# EAGLE design PCB_v2 (EAGLE 8.6.2)
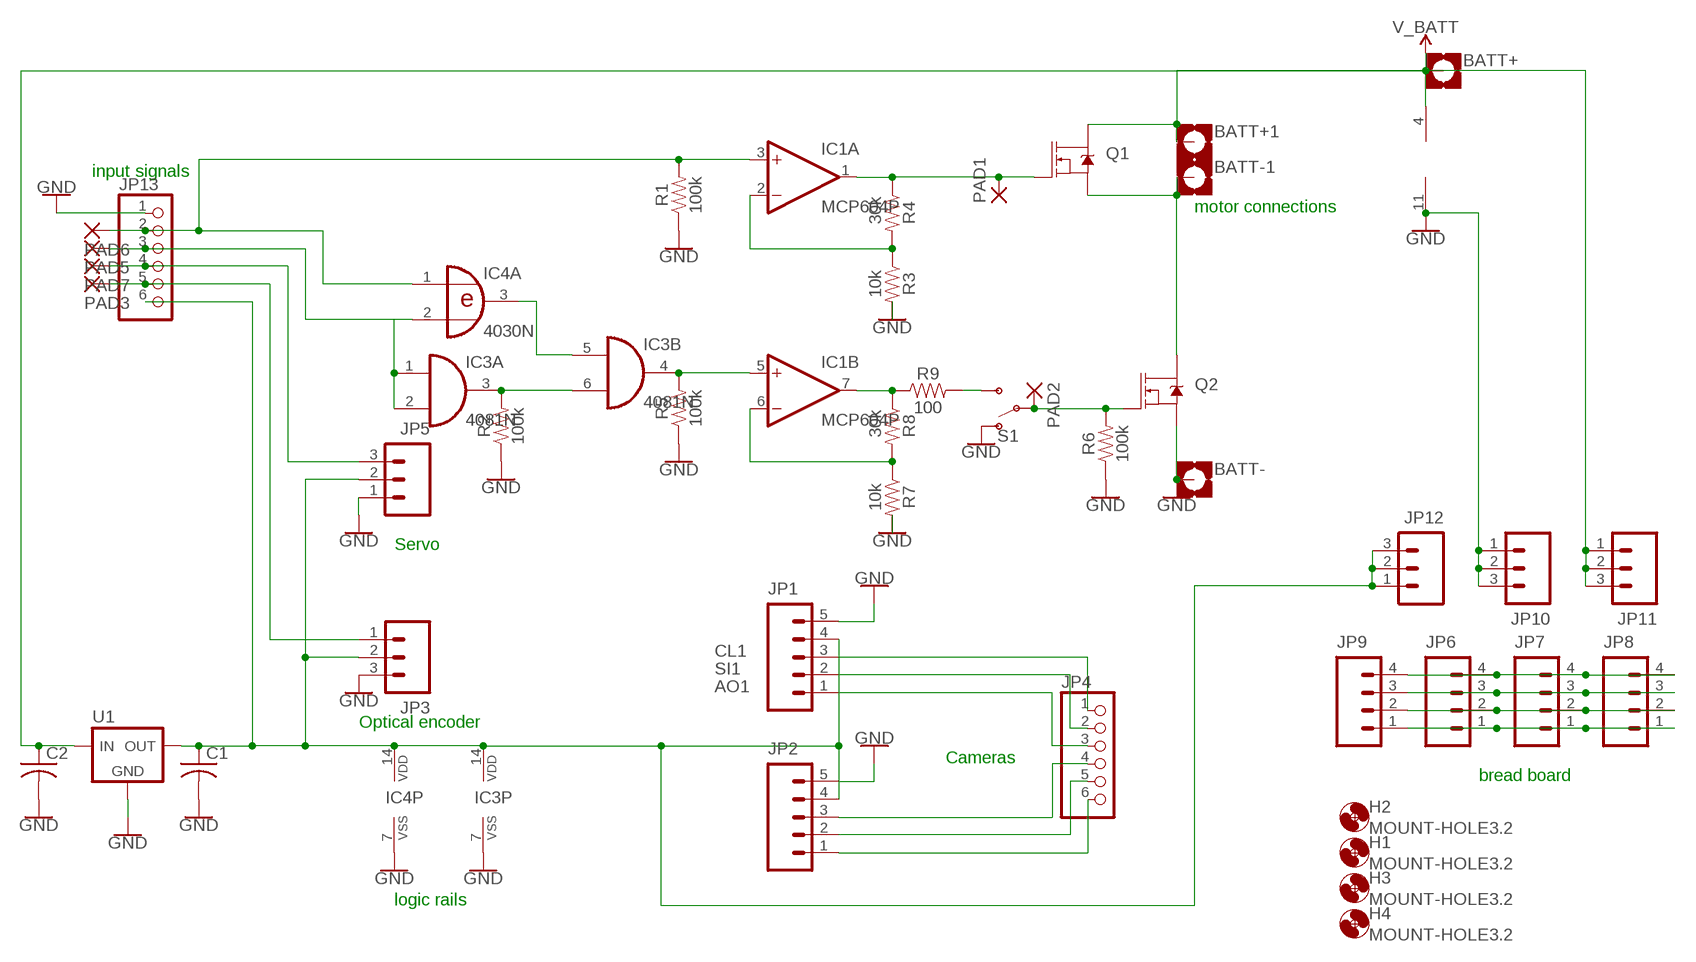
[diagram p0: schematic, sheet 1]

## Parts
BATT+  MOUNT-PAD-SQUARE3.0  [3,0-PAD-SQUARE]
BATT+1  MOUNT-PAD-SQUARE3.0  [3,0-PAD-SQUARE]
BATT-  MOUNT-PAD-SQUARE3.0  [3,0-PAD-SQUARE]
BATT-1  MOUNT-PAD-SQUARE3.0  [3,0-PAD-SQUARE]
C1  C-075PTH  [C075]
C2  C-075PTH  [C075]
H1  MOUNT-HOLE3.2  [3,2]
H2  MOUNT-HOLE3.2  [3,2]
H3  MOUNT-HOLE3.2  [3,2]
H4  MOUNT-HOLE3.2  [3,2]
IC1  MCP604P  [DIL14]
IC3  4081N  [DIL14]
IC4  4030N  [DIL14]
JP1  M05PTH  [1X05]
JP2  M05PTH  [1X05]
JP3  M03PTH  [1X03]
JP4  PINHD-1X6  [1X06]
JP5  M03PTH  [1X03]
JP6  M04PTH  [1X04]
JP7  M04PTH  [1X04]
JP8  M04PTH  [1X04]
JP9  M04PTH  [1X04]
JP10  M03PTH  [1X03]
JP11  M03PTH  [1X03]
JP12  M03PTH  [1X03]
JP13  PINHD-1X6  [1X06]
PAD1  2,15/1,0  [2,15/1,0]
PAD2  2,15/1,0  [2,15/1,0]
PAD3  2,15/1,0  [2,15/1,0]
PAD5  2,15/1,0  [2,15/1,0]
PAD6  2,15/1,0  [2,15/1,0]
PAD7  2,15/1,0  [2,15/1,0]
Q1  MOSFET-NCH-FQP30N06L  [TO220V]
Q2  MOSFET-NCH-FQP30N06L  [TO220V]
R1  100k  10KOHM-HORIZ-1/4W-1%  [AXIAL-0.3]
R2  100k  10KOHM-HORIZ-1/4W-1%  [AXIAL-0.3]
R3  10k  10KOHM-HORIZ-1/4W-1%  [AXIAL-0.3]
R4  30k  RESISTORAXIAL-0.3  [AXIAL-0.3]
R5  100k  10KOHM-HORIZ-1/4W-1%  [AXIAL-0.3]
R6  100k  10KOHM-HORIZ-1/4W-1%  [AXIAL-0.3]
R7  10k  10KOHM-HORIZ-1/4W-1%  [AXIAL-0.3]
R8  30k  RESISTORAXIAL-0.3  [AXIAL-0.3]
R9  100  10KOHM-HORIZ-1/4W-1%  [AXIAL-0.3]
S1  SWITCH-SPDT-PTH-11.6X4.0MM-KIT  [SWITCH_SPDT_PTH_11.6X4.0MM_KIT]
U1  78XX-TO220V  [TO220BV]

## Nets
AO1: JP1.1 JP4.3
CL1: JP1.3 JP4.1
GND: BATT-.B3,0(MOUNT) C1.2(-) C2.2(-) IC1.11(P:V-) IC3.7(P:VSS) IC4.7(P:VSS) JP1.5 JP2.5 JP3.3 JP5.1 JP10.1 JP10.2 JP10.3 JP13.1 Q2.3(S) R1.P$1 R2.P$1 R3.P$2 R5.P$1 R6.P$1 R7.P$2 S1.1(O) U1.2(GND)
N$1: IC1.2(A:-IN) R3.P$1 R4.P$2
N$2: IC1.1(A:OUT) PAD1.1(P) Q1.1(G) R4.P$1
N$3: IC1.6(B:-IN) R7.P$1 R8.P$2
N$4: R9.P$2 S1.3(S)
N$5: PAD2.1(P) Q2.1(G) R6.P$2 S1.2(P)
N$6: BATT-1.B3,0(MOUNT) Q1.3(S) Q2.2(D)
N$7: IC1.7(B:OUT) R8.P$1 R9.P$1
N$8: IC3.5(B:I0) IC4.3(A:O)
N$9: JP2.1 JP4.6
N$10: JP2.2 JP4.5
N$11: JP2.3 JP4.4
N$15: JP5.3 JP13.4 PAD7.1(P)
N$16: IC1.3(A:+IN) IC4.1(A:I0) JP13.2 PAD6.1(P) R1.P$2
N$18: C1.1(+) IC3.14(P:VDD) IC4.14(P:VDD) JP1.4 JP2.4 JP3.2 JP5.2 JP12.1 JP12.2 JP12.3 JP13.6 U1.3(VOUT)
N$19: JP3.1 JP13.5 PAD3.1(P)
N$20: IC1.5(B:+IN) IC3.4(B:O) R5.P$2
N$21: IC3.3(A:O) IC3.6(B:I1) R2.P$2
N$22: JP6.4 JP7.4 JP8.4 JP9.4
N$23: JP6.3 JP7.3 JP8.3 JP9.3
N$24: JP6.2 JP7.2 JP8.2 JP9.2
N$25: JP6.1 JP7.1 JP8.1 JP9.1
N$26: IC3.1(A:I0) IC3.2(A:I1) IC4.2(A:I1) JP13.3 PAD5.1(P)
SI1: JP1.2 JP4.2
V_BATT: BATT+1.B3,0(MOUNT) BATT+.B3,0(MOUNT) C2.1(+) IC1.4(P:V+) JP11.1 JP11.2 JP11.3 Q1.2(D) U1.1(VIN)
Unconnected: IC1.8(C:OUT) IC1.9(C:-IN) IC1.10(C:+IN) IC1.12(D:+IN) IC1.13(D:-IN) IC1.14(D:OUT) IC3.8(C:I0) IC3.9(C:I1) IC3.10(C:O) IC3.11(D:O) IC3.12(D:I0) IC3.13(D:I1) IC4.4(B:O) IC4.5(B:I0) IC4.6(B:I1) IC4.8(C:I0) IC4.9(C:I1) IC4.10(C:O) IC4.11(D:O) IC4.12(D:I0) IC4.13(D:I1)

## Notes on the sheet
- input signals
- motor connections
- Servo
- Optical encoder
- Cameras
- bread board
- logic rails

## Library data of the parts
BATT+ BATT+1 BATT- BATT-1 = holes:MOUNT-PAD-SQUARE: MOUNTING PAD, square
C1 C2 = bt_rcl:C: Capacitor, non-polarized, American symbol
H1-H4 = holes:MOUNT-HOLE: MOUNTING HOLE with drill center marker
IC1 = linear:MCP604: Quad Op Amp 2.7V to 6.0V Single Supply CMOS Source: http://ww1.microchip.com/downloads/en/DeviceDoc/21314g.pdf
IC3 = 40xx:4081: Quad 2-input AND
IC4 = 40xx:4030: Quad XOR
JP1 JP2 = ee192:M05: 5-pin 0.1-inch header and MTA connector Courtsey of Pioneers in Engineering; PIE-INT-REF-NUM: BULK-STOCK
JP3 JP5 JP10-JP12 = ee192:M03: 3-pin 0.1-inch header and MTA connector Courtsey of Pioneers in Engineering; PIE-INT-REF-NUM: BULK-STOCK
JP4 JP13 = pinhead:PINHD-1X6: PIN HEADER
JP6-JP9 = ee192:M04: 4-pin 0.1-inch header and MTA connector Courtsey of Pioneers in Engineering; PIE-INT-REF-NUM: BULK-STOCK
PAD1-PAD3 PAD5-PAD7 = wirepad:2,15/1,0: THROUGH-HOLE PAD
Q1 Q2 = SparkFun-DiscreteSemi:MOSFET-NCH: N-channel MOSFETs Voltage controlled devices that allow control of high current outputs. SparkFun Products: SparkFun OpenScale <https://www.sparkfun.com/products/13261> SparkFun Digital Sandbox <https://www.sparkfun.com/products/12651> SparkFun Monster Moto Shield <https://www.sparkfun.com/products/10182> SparkFun MOSFET Power Controller <https://www.sparkfun.com/products/11214>; PROD_ID: TRANS-10060; VALUE: 60V/32A/35mΩ
R1 R2 R5 R6 R9 = SparkFun-Resistors:10KOHM: 10kΩ resistor A resistor is a passive two-terminal electrical component that implements electrical resistance as a circuit element. Resistors act to reduce current flow, and, at the same time, act to lower voltage levels within circuits. - Wikipedia; PROD_ID: RES-12183; VALUE: 10k
R3 R7 = SparkFun-Resistors:10KOHM: 10kΩ resistor A resistor is a passive two-terminal electrical component that implements electrical resistance as a circuit element. Resistors act to reduce current flow, and, at the same time, act to lower voltage levels within circuits. - Wikipedia; PROD_ID: RES-12183
R4 R8 = SparkFun-Resistors:RESISTOR: Generic Resistor Package
S1 = SparkFun-Switches:SWITCH-SPDT: Single Pole, Double Throw (SPDT) Switch Single-pole, double-throw (SPDT) switch. Variant Overview SMD-AYZ0202 Surface Mount DPDT Switch <https://www.sparkfun.com/products/597> (COM-00597) Used on e.g. LilyPad Arduino USB - ATmega32U4 Board <https://www.sparkfun.com/products/12049> PTH-11.6X4.0MM SPDT Mini Power Switch <https://www.sparkfun.com/products/102> (COM-00102) Used on e.g. SparkFun Simon Says - Through-Hole Soldering Kit <https://www.sparkfun.com/products/10547> (KIT-10547) PTH-11.6X4.0MM-KIT KIT version of SPDT Mini Power Switch - Simplifies soldering by removing tStop of switch pins - only one side can be soldered. PTH-11.6X4.0MM-LOCK LOCK version of SPDT Mini Power Switch - Offset pins hold switch in place for easier soldering. SMD-RIGHT-ANGLE Surface Mount Right Angle Switch <https://www.sparkfun.com/products/10860> (COM-10860) Used on e.g. SparkFun ESP8266 Thing <https://www.sparkfun.com/products/13231>; PROD_ID: SWCH-08261; SF_SKU: COM-00102
U1 = bt_regulator:78XX: 78XX Linear Voltage Regulator The venerable 7800-series Linear Voltage Regulator, including 7805, 7809, 7812, 7815, 7862 in 5 V, 6.2 V, 8.2 V, 9 V, 12 V, and 15 V, respectively Datasheets TI_LM78L05.pdf <http://www.ti.com/lit/ds/symlink/lm78l05.pdf> Fairchild_LM7805.pdf <https://www.fairchildsemi.com/datasheets/LM/LM7805.pdf>

## Board
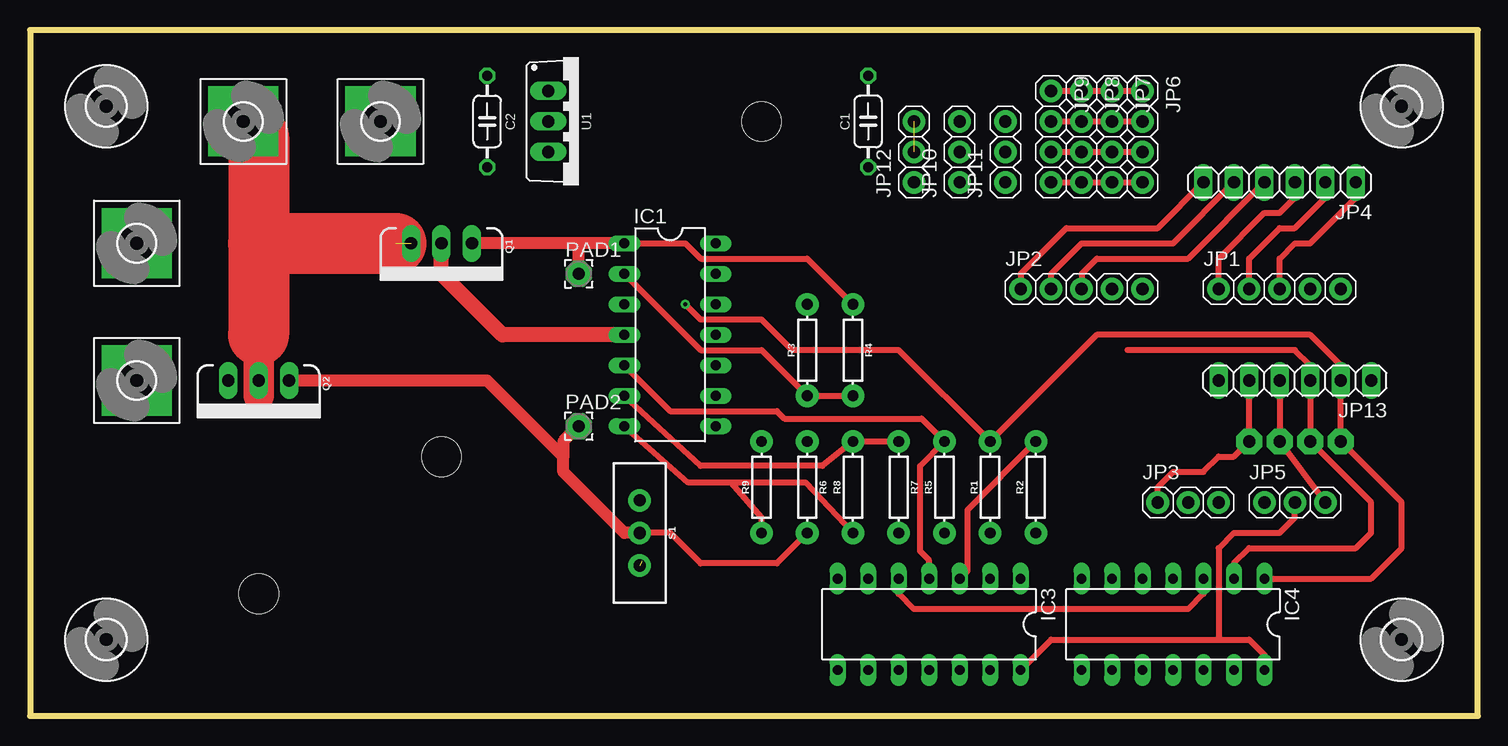
[diagram p1: board, top side]
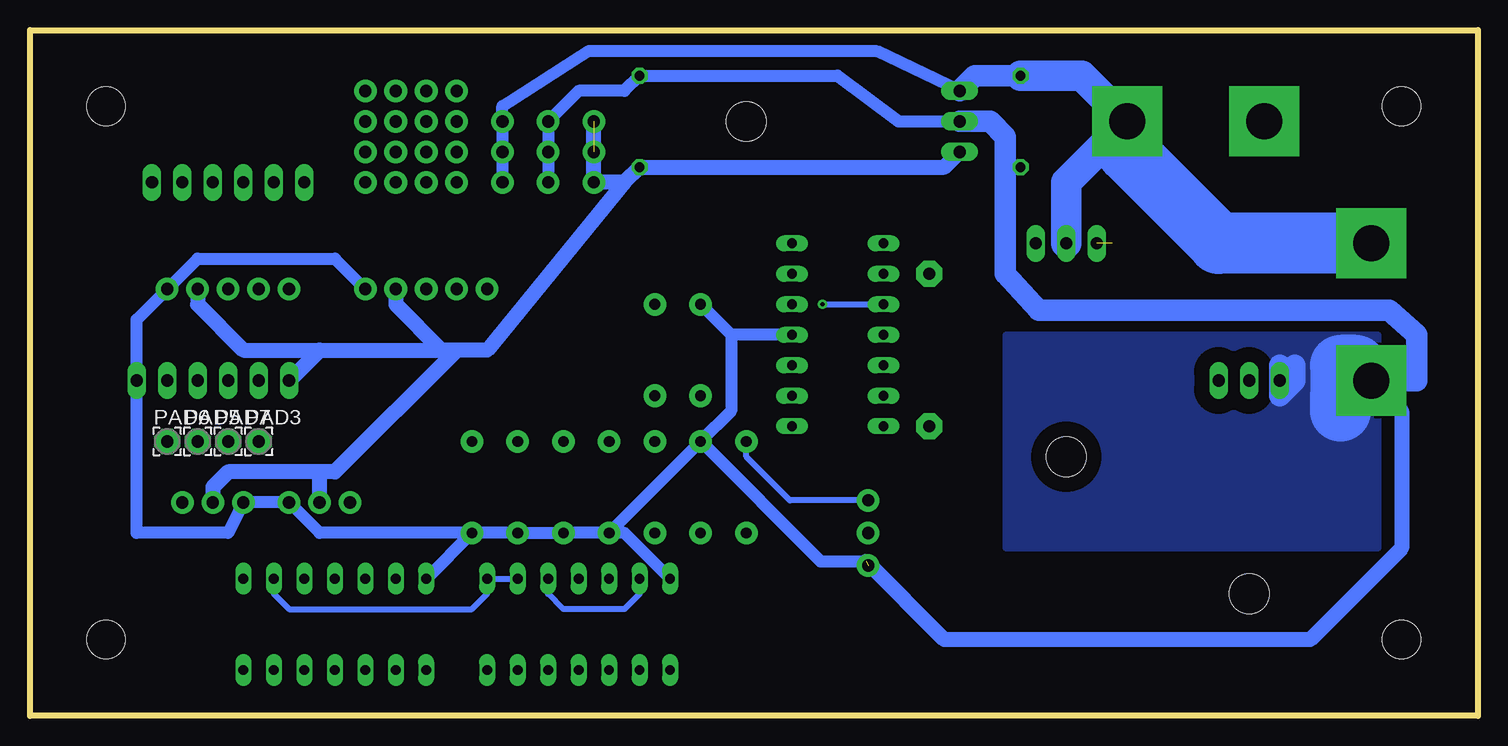
[diagram p2: board, bottom side, seen from below]

Size 120.65 x 57.15 mm. Coordinates in mm from the lower left corner, seen from the top.
Outline: 0,57.15 0,0 120.65,0 120.65,57.15 0,57.15
Copper layers (1*16): Top 0.035mm / dielectric 1.5mm / Bottom 0.035mm
Design rules "default": minimum track width 6mil, minimum drill 0.35mm, track to track 6mil, track to pad 6mil, pad to pad 6mil, via to via 6mil, smd to smd 6mil, copper to edge 40mil, drill to drill 6mil, minimum pad ring 10mil, minimum via ring 8mil, stop-mask expansion 4mil, vias tented up to drill 0mil, thermal gap 10mil
Holes 3.3 mm at 34.29,21.59 19.05,10.16 60.96,49.53

### Footprints (pad centres in the part's own frame; a part is rotated, then mirrored left to right if it is on the bottom)
3,0-PAD-SQUARE = drill 3 pad 5.842 square: B3,0 0,0
C075 = drill 0.813 octagon: 1 -3.81,0; 2 3.81,0
3,2 = hole 3.2: 0,0
DIL14 = drill 0.813 long: 1 -7.62,-3.81; 2 -5.08,-3.81; 3 -2.54,-3.81; 4 0,-3.81; 5 2.54,-3.81; 6 5.08,-3.81; 7 7.62,-3.81; 8 7.62,3.81; 9 5.08,3.81; 10 2.54,3.81; 11 0,3.81; 12 -2.54,3.81; 13 -5.08,3.81; 14 -7.62,3.81
1X05 = drill 1.016 pad 1.88: 1 -5.08,0; 2 -2.54,0; 3 0,0; 4 2.54,0; 5 5.08,0
1X03 = drill 1.016 pad 1.88: 1 -2.54,0; 2 0,0; 3 2.54,0
1X06 = drill 1.016 long: 1 -6.35,0; 2 -3.81,0; 3 -1.27,0; 4 1.27,0; 5 3.81,0; 6 6.35,0
1X04 = drill 1.016 pad 1.88: 1 -3.81,0; 2 -1.27,0; 3 1.27,0; 4 3.81,0
2,15/1,0 = drill 1.016 pad 2.159 octagon: 1 0,0
TO220V = drill 1.016 long: 1 -2.54,0; 2 0,0; 3 2.54,0
AXIAL-0.3 = drill 0.9 pad 1.88: P$1 -3.81,0; P$2 3.81,0
SWITCH_SPDT_PTH_11.6X4.0MM_KIT = drill 1.016 pad 1.88: 1 0,2.718; 2 0,0; 3 0,-2.718
TO220BV = drill 1.016 long: 1 -2.54,0; 2 0,0; 3 2.54,0

### Placement (x,y rotation side)
BATT+  8.89,39.37 0 top
BATT+1  29.21,49.53 0 top
BATT-  8.89,27.94 0 top
BATT-1  17.78,49.53 0 top
C1  69.85,49.53 90 top
C2  38.1,49.53 270 top
H1  114.3,6.35 0 top
H2  114.3,50.8 0 top
H3  6.35,50.8 0 top
H4  6.35,6.35 0 top
IC1  53.34,31.75 270 top
IC3  74.93,7.62 180 top
IC4  95.25,7.62 180 top
JP1  104.14,35.56 0 top
JP2  87.63,35.56 0 top
JP3  96.52,17.78 0 top
JP4  104.14,44.45 180 top
JP5  105.41,17.78 0 top
JP6  92.71,48.26 270 top
JP7  90.17,48.26 270 top
JP8  87.63,48.26 270 top
JP9  85.09,48.26 270 top
JP10  77.47,46.99 90 top
JP11  81.28,46.99 90 top
JP12  73.66,46.99 90 top
JP13  105.41,27.94 180 top
PAD1  45.72,36.83 0 top
PAD2  45.72,24.13 0 top
PAD3  101.6,22.86 0 bottom
PAD5  106.68,22.86 0 bottom
PAD6  109.22,22.86 0 bottom
PAD7  104.14,22.86 0 bottom
Q1  34.29,39.37 180 top
Q2  19.05,27.94 180 top
R1  80.01,19.05 90 top
R2  83.82,19.05 90 top
R3  64.77,30.48 90 top
R4  68.58,30.48 270 top
R5  76.2,19.05 90 top
R6  64.77,19.05 270 top
R7  72.39,19.05 270 top
R8  68.58,19.05 90 top
R9  60.96,19.05 90 top
S1  50.8,15.24 180 top
U1  43.18,49.53 270 top

### Tracks (layer width: path | path; a pad name or v marks a point on that pad's centre or on a via)
AO1
  Top 0.508: JP1.1 99.06,38.1 102.87,41.91 104.14,41.91 105.41,43.18 JP4.3
CL1
  Top 0.508: JP1.3 104.14,38.1 105.41,39.37 106.68,39.37 110.49,43.18 JP4.1
GND  (1 unrouted)
  Bottom 1.016: R7.P$2 R5.P$1 R1.P$1 R2.P$1 | R6.P$1 R7.P$2 | R3.P$2 62.23,31.75 | 62.23,31.75 62.23,25.4 R6.P$1 | IC1.11 62.23,31.75 | U1.2 48.26,49.53 53.34,53.34 C1.2 71.12,52.07 74.93,52.07 JP10.3 JP10.2 JP10.1 | R2.P$1 96.52,15.24 JP3.3 JP5.1 104.14,15.24 111.76,15.24 JP13.1 111.76,33.02 JP1.5 106.68,38.1 95.25,38.1 JP2.5 | R2.P$1 IC4.7 | IC3.7 71.12,15.24 R7.P$2 | R6.P$1 54.79,12.88 50.98,12.88
  Bottom 1.27: C2.2 39.37,45.72 | BATT-.B3,0 6.35,25.4 6.35,13.97 13.97,6.35 44.45,6.35 50.98,12.88
  Bottom 1.778: U1.2 40.64,49.53 39.37,48.26 39.37,45.72 39.37,36.83 36.58,33.78 7.37,33.78 5.08,31.75 5.08,27.94 BATT-.B3,0 | 16.51,29.21 Q2.3 | Q2.3 16.51,26.67 15.24,27.94 15.24,29.21 Q2.3
  Bottom 5.08: 11.43,26.67 11.43,29.21 10.16,29.21 BATT-.B3,0 10.16,27.94 11.43,26.67 | 11.43,25.4 11.43,26.67
  pour Bottom (isolate 1.27): 8.26,31.75 39.37,31.75 39.37,13.97 8.26,13.97
N$1
  Top 0.508: R4.P$2 R3.P$1 60.96,30.48 55.88,30.48 IC1.2
N$2
  Top 0.508: IC1.1 54.61,39.37 55.88,38.1 64.77,38.1 R4.P$1
  Top 1.016: 45.72,39.37 Q1.1 | IC1.1 45.72,39.37 | PAD1.1 45.72,39.37
N$3
  Top 0.508: R7.P$1 R8.P$2 66.04,20.83 55.88,20.83 IC1.6
N$4
  Bottom 0.508: R9.P$2 60.96,21.59 57.33,17.96 S1.3
N$5
  Top 0.508: R6.P$2 62.23,12.7 55.88,12.7 53.34,15.24 S1.2
  Top 1.016: 44.45,21.59 38.1,27.94 Q2.1 | S1.2 49.53,15.24 44.45,20.32 44.45,21.59 | PAD2.1 44.45,22.86 44.45,21.59
N$6  (1 unrouted)
  Top 1.016: 19.05,31.75 19.05,30.48
  Top 2.54: 19.05,30.48 Q2.2 19.05,26.67
  Top 5.08: BATT-1.B3,0 19.05,48.26 19.05,39.37 | 19.05,39.37 19.05,31.75 | 19.05,39.37 30.48,39.37
N$7
  Top 0.508: R8.P$1 64.64,19.43 58.42,19.43 | 58.42,19.43 54.86,19.43 IC1.7 | R9.P$1 60.96,16.51 58.42,19.43
N$8
  Top 0.508: IC4.3 97.79,10.16 96.52,8.89 73.66,8.89 72.39,10.16 IC3.5
N$9
  Top 0.508: JP2.1 82.55,36.83 86.36,40.64 93.98,40.64 JP4.6
N$10
  Top 0.508: JP2.2 85.09,36.83 87.63,39.37 95.25,39.37 JP4.5
N$11
  Top 0.508: JP2.3 87.63,36.83 88.9,38.1 96.52,38.1 JP4.4
N$15
  Top 0.508: JP5.3 PAD7.1 JP13.4
N$16  (via drill 0.35)
  Top 0.508: v54.61,34.29 55.88,33.02 60.96,33.02 63.5,30.48 72.39,30.48 R1.P$2 88.9,31.75 106.68,31.75 109.22,29.21 JP13.2 PAD6.1 114.3,17.78 114.3,13.97 111.76,11.43 IC4.1
  Bottom 0.508: v54.61,34.29 IC1.3
N$18  (1 unrouted)
  Top 0.508: IC3.14 85.09,6.35 99.06,6.35 | 99.06,6.35 101.6,6.35 102.87,5.08 IC4.14 | 99.06,6.35 99.06,13.97 100.33,15.24 104.14,15.24 105.41,16.51 JP5.2
  Bottom 1.27: 85.09,30.48 86.36,30.48 | 85.09,30.48 95.25,20.32 96.52,20.32 | U1.3 44.45,45.72 C1.1 71.12,44.45 | 96.52,20.32 104.14,20.32 105.41,19.05 JP5.2 | JP2.4 90.17,34.29 86.36,30.48 | JP1.4 106.68,34.29 102.87,30.48 96.52,30.48 | 96.52,30.48 86.36,30.48 | 71.12,44.45 JP12.1 JP12.3 | 71.12,44.45 82.55,30.48 85.09,30.48 | JP13.6 96.52,30.48 | JP3.2 96.52,20.32
N$19
  Top 0.508: JP13.5 PAD3.1 100.33,21.59 99.06,21.59 97.79,20.32 95.25,20.32 93.98,19.05 JP3.1
N$20
  Top 0.508: IC1.5 53.34,25.4 62.23,25.4 62.87,24.76 74.3,24.76 R5.P$2 74.17,20.83 74.17,13.72 74.93,12.95 IC3.4
N$21
  Top 0.508: R2.P$2 78.11,17.14 78.11,12.07 IC3.3
  Bottom 0.508: IC3.6 69.85,10.16 71.12,8.89 76.2,8.89 77.47,10.16 IC3.3
N$22
  Top 0.508: JP9.4 JP8.4 JP7.4 JP6.4
N$23
  Top 0.508: JP9.3 JP8.3 JP7.3 JP6.3
N$24
  Top 0.508: JP9.2 JP8.2 JP7.2 JP6.2
N$25
  Top 0.508: JP9.1 JP8.1 JP7.1 JP6.1
N$26
  Top 0.508: IC4.2 100.33,12.7 101.6,13.97 110.49,13.97 111.76,15.24 111.76,17.78 PAD5.1 JP13.3 106.68,29.21 105.41,30.48 91.44,30.48
  Bottom 0.508: IC4.2 100.33,10.16 99.06,8.89 83.82,8.89 82.55,10.16 IC3.1 IC3.2
SI1
  Top 0.508: JP1.2 101.6,38.1 104.14,40.64 105.41,40.64 107.95,43.18 JP4.2
V_BATT
  Top 1.27: IC1.4 39.37,31.75 34.29,36.83 Q1.2
  Bottom 1.016: U1.1 50.04,55.37 74.17,55.37 81.28,50.8 JP11.3 JP11.2 JP11.1
  Bottom 1.778: C2.1 41.91,53.34 U1.1
  Bottom 2.54: Q1.2 34.29,44.45 BATT+1.B3,0 33.02,53.34 C2.1
  Bottom 5.08: 29.21,48.26 BATT+1.B3,0 29.21,46.99 21.59,39.37 BATT+.B3,0